# Altium schematic sheet UART 1.SchDoc
size A4; SheetNumber: 5; SheetTotal: 7
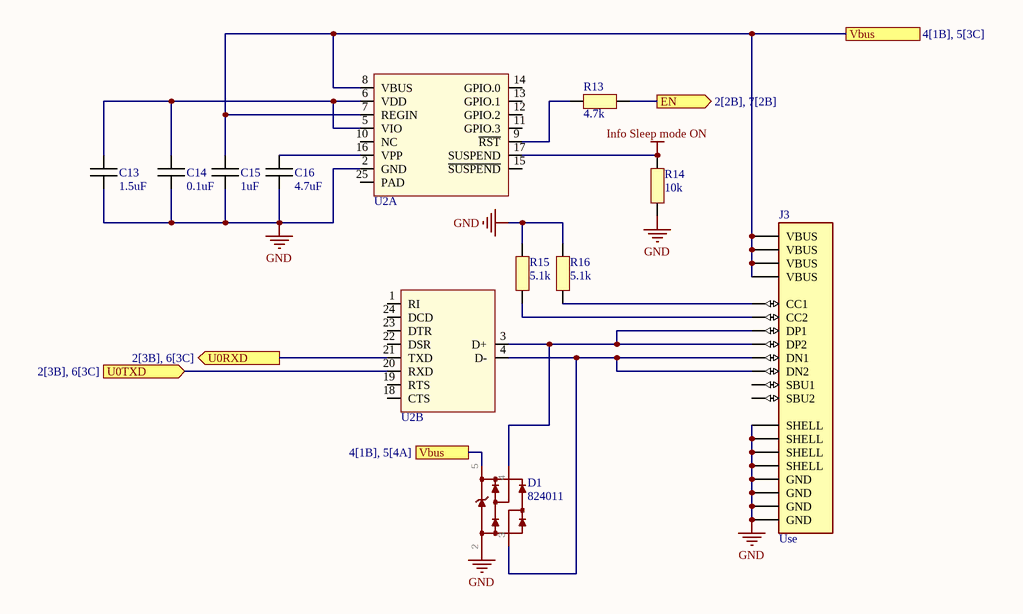
[diagram p0: UART 1.SchDoc]

## Parts
C13  1.5uF  [CAPC1005X06N]
C14  0.1uF  [CAPC1005X06N]
C15  1uF  [CAPC1005X06N]
C16  4.7uF  [CAPC1005X06N]
D1  824011  [824011]
J3  Use  [USB4085-GF-A]
R13  4.7k  [RESC1005X06N]
R14  10k  [RESC1005X06N]
R15  5.1k  [RESC1005X06N]
R16  5.1k  [RESC1005X06N]
U2  CP2104-F03-GM  [PQFN50P400X400X80_HS-25N]  (value not drawn)  (parts A,B of 2)

## Ports
EN (out, see 2[2B], 7[2B]), U0RXD (out, see 2[3B], 6[3C]), U0TXD (in, see 2[3B], 6[3C]), Vbus (see 4[1B], 5[3C]), Vbus (see 4[1B], 5[4A])

## Nets
GND: C13.2 C14.2 C15.2 C16.2 D1.2(GND) J3.A1(GND) J3.A12(GND) J3.B1(GND) J3.B12(GND) J3.S1(SHELL) J3.S2(SHELL) J3.S3(SHELL) J3.S4(SHELL) R14.2 R15.2 R16.2 U2.2(GND)
Info Sleep mode ON: R14.1 U2.17(SUSPEND)
EN: R13.1 ; port EN
U0RXD: U2.21(TXD) ; port U0RXD
U0TXD: U2.20(RXD) ; port U0TXD
Vbus: C15.1 D1.5(VDD) J3.A4(VBUS) J3.A9(VBUS) J3.B4(VBUS) J3.B9(VBUS) U2.7(REGIN) U2.8(VBUS) ; port Vbus
NetC13_1: C13.1 C14.1 U2.5(VIO) U2.6(VDD)
NetC16_1: C16.1 U2.16(VPP)
NetD1_3: D1.3 J3.A7(DN1) J3.B7(DN2) U2.4(D-)
NetD1_4: D1.4 J3.A6(DP1) J3.B6(DP2) U2.3(D+)
NetJ3_A5: J3.A5(CC1) R16.1
NetJ3_B5: J3.B5(CC2) R15.1
NetR13_2: R13.2 U2.9(~{RST})

Not connected (* = marked no-connect by the designer): J3 A8(SBU1) B8(SBU2); U2 1(RI) 10(NC) 11(GPIO.3) 12(GPIO.2) 13(GPIO.1) 14(GPIO.0) 15(~{SUSPEND}) 18(CTS) 19(RTS) 22(DSR) 23(DTR) 24(DCD) 25(PAD)

## Library data of the parts
C13-C16 = Capacitor
D1 = 824011: TVS Diode Array WE-TVS, High Speed Series  - Low capazity - No leakage current - Low clamping voltage - high ESD voltage protection  -- USB 1.0 - 2.0
J3 = USB4085-GF-A: Connecteurs USB USB Type C, 2.0, Rec, TH , G/F, RA , Top Mnt, T & R
R13-R16 = Resistor
U2 = USBBridge: USB Bridge, USB to UART USB 2.0 UART Interface 24-QFN (4x4); Manufacturer 1: Silicon Labs; Supplier 1: Arrow Electronics; Supplier Part Number 1: CP2104-F03-GM; Manufacturer Part Number 1: CP2104-F03-GM